# Altium project UWRT_Project_Template.PrjPcb
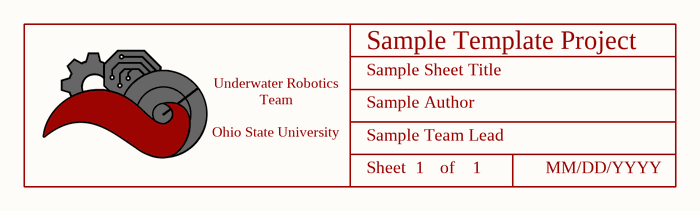
[diagram p0: Sch_Sheet_Template.SchDoc]
TeamLead: Sample Team Lead; ProjectTitle: Sample Template Project; DateOfDesignReview: XX/XX/XXXX; BoardRevision: 1.0
1 sheet, 1 parts. Net scope: global (net labels, ports and power ports of the same name join across sheets).
Board files: Pcb_4layer_4x4_Template.PcbDoc, Pcb_2layer_4x4_Template.PcbDoc, Pcb_2layer_8x4_Template_NoCenterHoles.PcbDoc, Pcb_4layer_8x4_Template_NoCenterHoles.PcbDoc, Pcb_2layer_8x4_Template.PcbDoc, Pcb_4layer_8x4_Template.PcbDoc

## Sheet Sch_Sheet_Template.SchDoc: Sample Sheet Title
size B; Date: MM/DD/YYYY; Author: Sample Author; Organization: ORGANIZATION; Address1: ADDRESS 1; Address2: ADDRESS 2; Address3: ADDRESS 3; Address4: ADDRESS 4; Revision: -; SheetNumber: 1; SheetTotal: 1; ENG_APP_DATE: --/--/--; DSN_APP_DATE: --/--/--; CHK_APP_DATE: --/--/--

### Parts
*  Title_Block  [LOGO]  (value not drawn)  (graphical)

### Notes on the sheet
- DWG. NO.
- REV.
- SHT.
- THIS DOCUMENT AND THE DATA DISCLOSED HEREIN OR HEREWITH IS THE PROPERTY OF ALTIUM LIMITED AND MAY BE FREELY DISTRIBUTED IN WHOLE. NO RIGHTS ARE RESERVED OR EXPRESS OR IMPLIED WARANTEE GIVEN.
- REVISION
- DESCRIPTION
- DATE
- APPROVED
- ENG:
- APPROVALS
- PROJECT
- DSN:
- CHK:
- REFERENCE DOCUMENTS
- PROJECT REVISION:
- TITLE
- DOCUMENT REVISION:
- DESIGN ITEM:
- BOM:
- FAB DWG:
- PCB DWG:
- ASSY DWG:
- SCALE:
- SIZE
- B
- CAGE CODE
- FILE NAME
- DWG NO.
- SHEET
- OF
- REV

### Library data of the parts
* = Title_Block: UWRT Schematic Title Block Template / Created June 2021, Dylan Trainor